# Altium schematic sheet Gen_func.SchDoc: **
size A4; Author: **; CompanyName: Introducción al Diseño de Circuitos Impresos; Organization: UTN FRBA; Revision: **
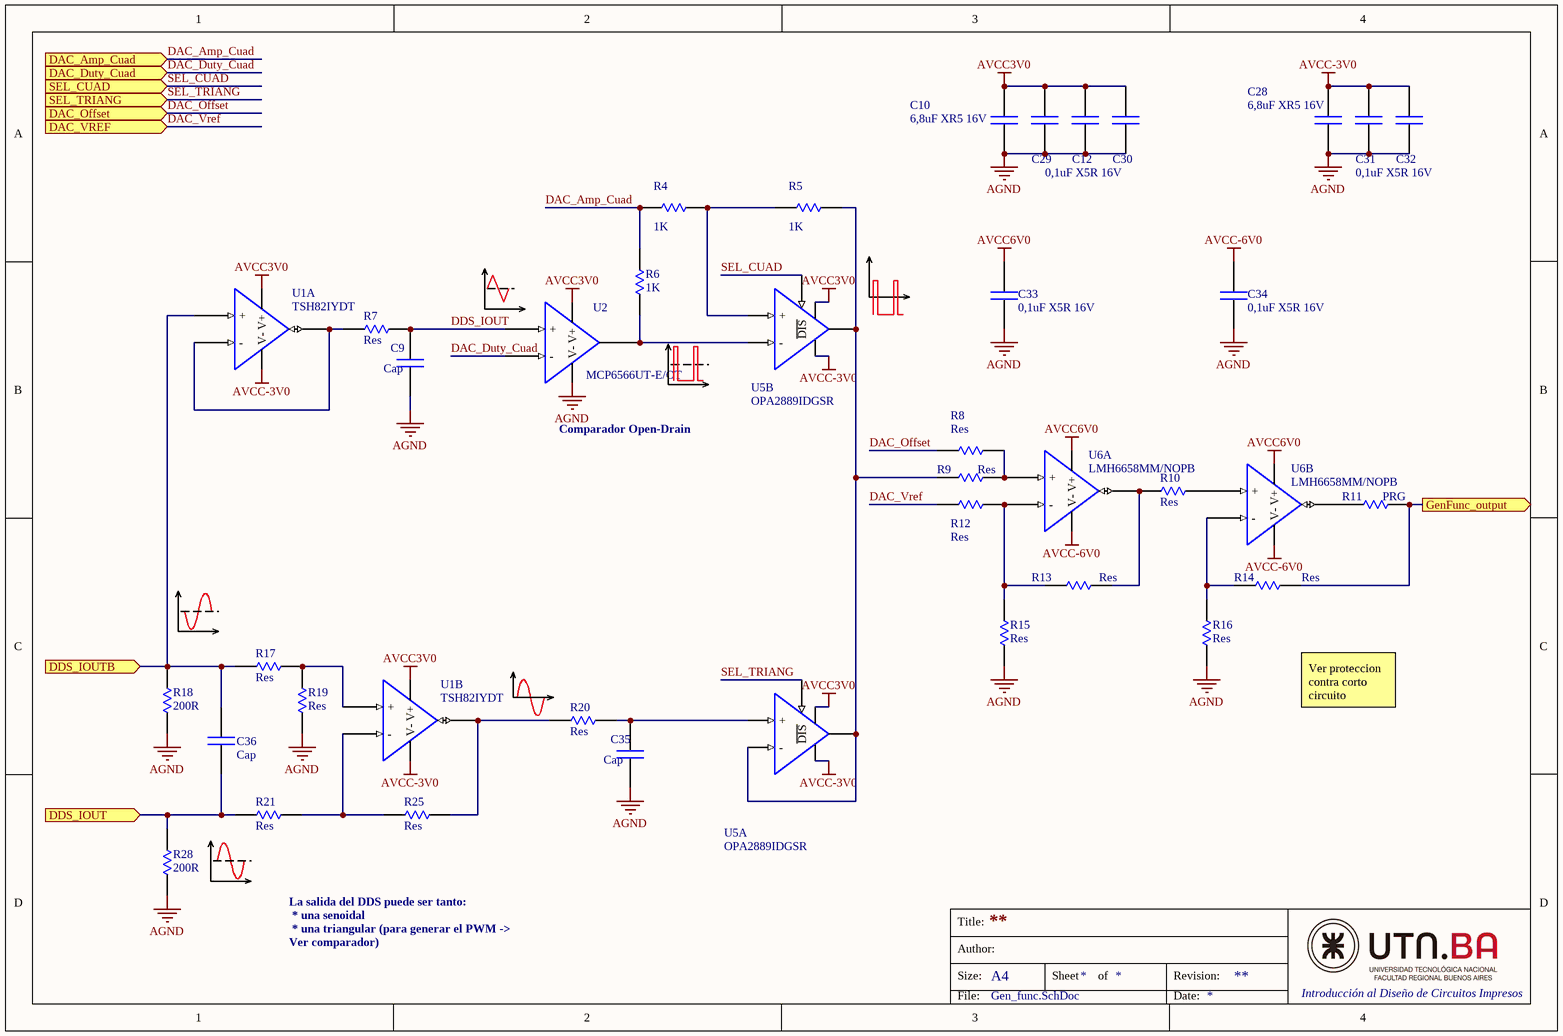
[diagram p0: Gen_func.SchDoc]

## Parts
C9  Cap  [C_0603]
C10  6,8uF XR5 16V  [C_0805]
C12  0,1uF X5R 16V  [C_0603]  (value not drawn)
C28  6,8uF XR5 16V  [C_0805]
C29  0,1uF X5R 16V  [C_0603]
C30  0,1uF X5R 16V  [C_0603]  (value not drawn)
C31  0,1uF X5R 16V  [C_0603]
C32  0,1uF X5R 16V  [C_0603]  (value not drawn)
C33  0,1uF X5R 16V  [C_0603]
C34  0,1uF X5R 16V  [C_0603]
C35  Cap  [C_0603]
C36  Cap  [C_0603]
R4  1K  [R_0603]
R5  1K  [R_0603]
R6  1K  [R_0603]
R7  Res  [R_0603]
R8  Res  [R_0603]
R9  Res  [R_0603]
R10  Res  [R_0603]
R11  PRG  [R_0603]
R12  Res  [R_0603]
R13  Res  [R_0603]
R14  Res  [R_0603]
R15  Res  [R_0603]
R16  Res  [R_0603]
R17  Res  [R_0603]
R18  200R  [R_0603]
R19  Res  [R_0603]
R20  Res  [R_0603]
R21  Res  [R_0603]
R25  Res  [R_0603]
R28  200R  [R_0603]
U1  TSH82IYDT  [SOIC_8]  (parts A,B of 2)
U2  MCP6566UT-E/OT  [SOT_23]
U5  OPA2889IDGSR  [MSOP_10]  (parts A,B of 2)
U6  LMH6658MM/NOPB  [VSSOP_8]  (parts A,B of 2)

## Ports
DAC_Amp_Cuad (in), DAC_Duty_Cuad (in), DAC_Offset (in), DAC_VREF (in), DDS_IOUT (in), DDS_IOUTB (in), GenFunc_output (out), SEL_CUAD (in), SEL_TRIANG (in)

## Nets
AGND: C9.2 C10.2 C12.2 C28.2 C29.2 C30.2 C31.2 C32.2 C33.2 C34.2 C35.2 R15.1 R16.1 R18.1 R19.1 R28.1 U2.2(V-)
AVCC3V0: C10.1 C12.1 C29.1 C30.1 U1.8(V+) U2.5(V+) U5.8(V+)
AVCC6V0: C33.1 U6.8(V+)
AVCC-3V0: C28.1 C31.1 C32.1 U1.4(V-) U5.3(V-)
AVCC-6V0: C34.1 U6.4(V-)
DAC_Amp_Cuad: R4.1 R6.2 ; port DAC_Amp_Cuad
DAC_Duty_Cuad: U2.4(-) ; port DAC_Duty_Cuad
DAC_Offset: R8.1 ; port DAC_Offset
DAC_Vref: R12.1 ; port DAC_VREF
DDS_IOUT: C9.1 R7.2 U2.3(+)
DDS_IOUT: C36.2 R21.2 R28.2 ; port DDS_IOUT  [a separate net that carries the same name]
DDS_IOUTB: C36.1 R17.1 R18.2 U1.3(+) ; port DDS_IOUTB
GenFunc_output: R11.2 R14.2 ; port GenFunc_output
SEL_CUAD: U5.4(~{DIS}) ; port SEL_CUAD
SEL_TRIANG: U5.2(~{DIS}) ; port SEL_TRIANG
NetC35_1: C35.1 R20.1 U5.1(+)
NetR4_2: R4.2 R5.2 U5.5(+)
NetR5_1: R5.1 R9.1 U5.7(Vout) U5.9(Vout) U5.10(-)
NetR6_1: R6.1 U2.1(Vout) U5.6(-)
NetR7_1: R7.1 U1.1(Vout) U1.2(-)
NetR8_2: R8.2 R9.2 U6.3(+)
NetR10_1: R10.1 R13.2 U6.1(Vout)
NetR10_2: R10.2 U6.5(+)
NetR11_1: R11.1 U6.7(Vout)
NetR12_2: R12.2 R13.1 R15.2 U6.2(-)
NetR14_1: R14.1 R16.2 U6.6(-)
NetR17_2: R17.2 R19.2 U1.5(+)
NetR20_2: R20.2 R25.1 U1.7(Vout)
NetR21_1: R21.1 R25.2 U1.6(-)

## Notes on the sheet
- Comparador Open-Drain
- Ver proteccion contra corto circuito
- La salida del DDS puede ser tanto:
  * una senoidal
  * una triangular (para generar el PWM -> Ver comparador)
- Title:
- Size:
- Author:
- A4
- Sheet
- of
- Revision:
- File:
- Date:

## Library data of the parts
C9 C10 C12 C28-C36 = Cap: Capacitor
R4-R21 R25 R28 = Res: Resistor
U1 = OpAmp_x2: Manufacturer: ST
U2 = Comp: Comparator
U5 = OpAmp_Dis: OpAmp_Disable_x2
U6 = OpAmp_x2